# Altium project PCB_Project_1.PrjPcb
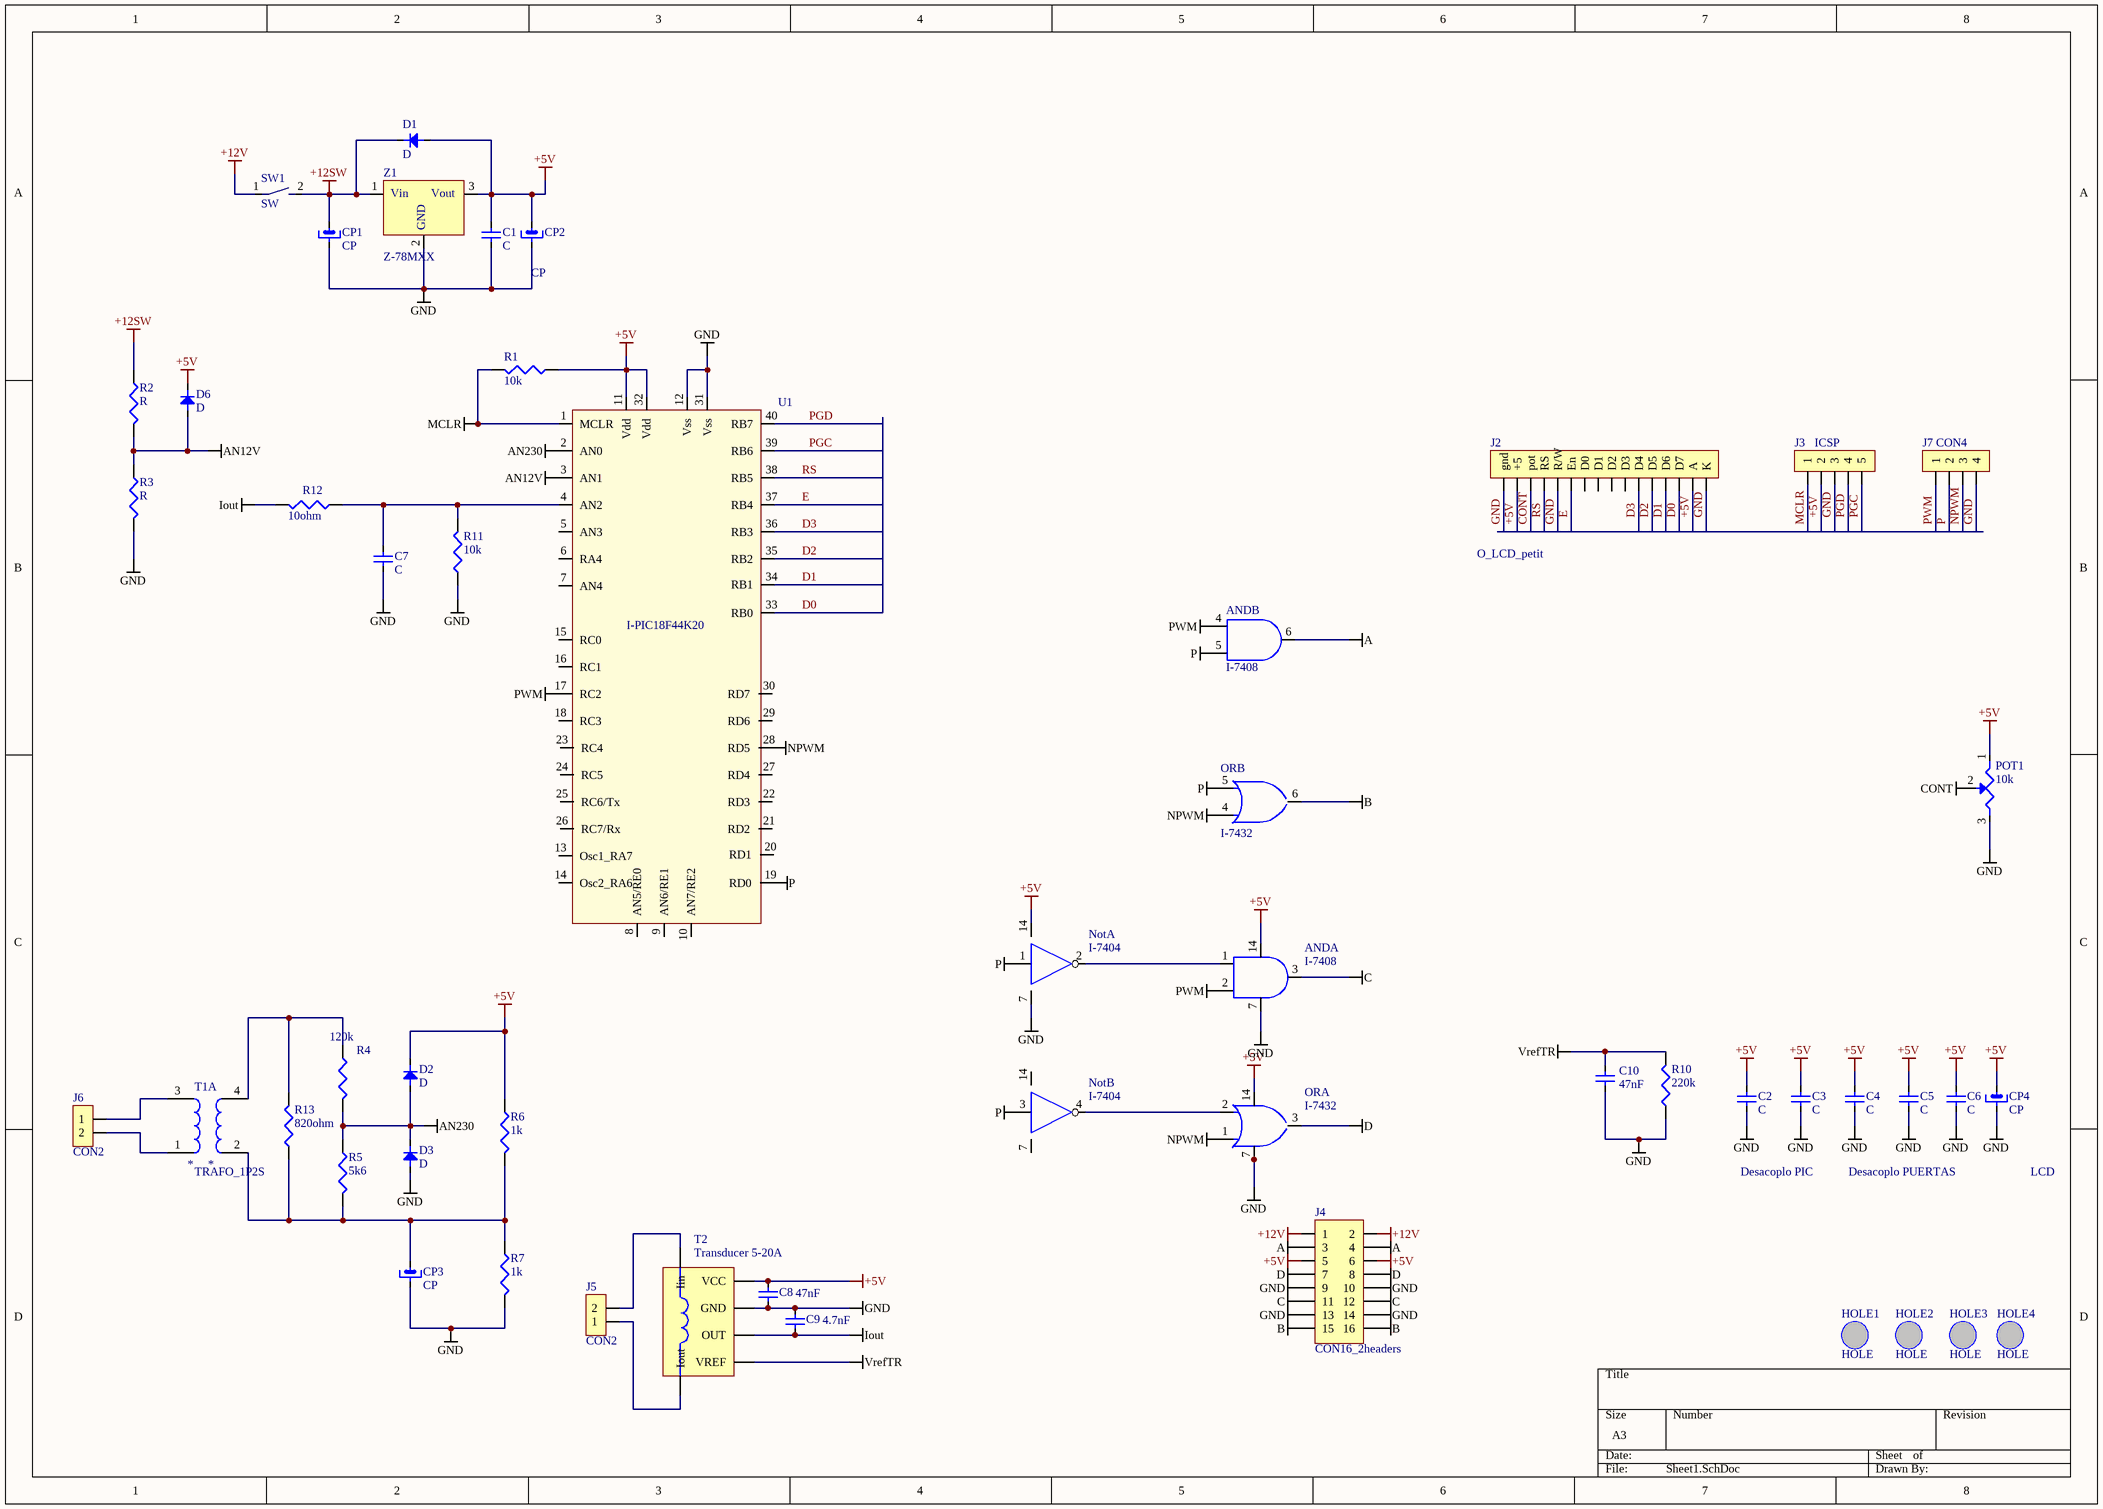
[diagram p0: Sheet1.SchDoc]
1 sheet, 48 parts. Net scope: global (net labels, ports and power ports of the same name join across sheets).
Board file: PCB1.PcbDoc

## Sheet Sheet1.SchDoc
size A3

### Parts
AND  I-7408  [DIP14]  (parts A,B of 4)
C1  C  [C2_200mils]
C2  C  [C2_200mils]
C3  C  [C2_200mils]
C4  C  [C2_200mils]
C5  C  [C2_200mils]
C6  C  [C2_200mils]
C7  C  [C2_200mils]
C8  47nF  [C2_200mils]
C9  4.7nF  [C2_200mils]
C10  47nF  [C2_200mils]
CP1  CP  [CP1_D5i5]
CP2  CP  [CP1_D5i5]
CP3  CP  [CP1_D5i5]
CP4  CP  [CP1_D5i5]
D1  D  [DO35]
D2  D  [DO35]
D3  D  [DO35]
D6  D  [DO35]
HOLE1  HOLE  [HOLE3_D6]
HOLE2  HOLE  [HOLE3_D6]
HOLE3  HOLE  [HOLE3_D6]
HOLE4  HOLE  [HOLE3_D6]
J2  O_LCD_petit  [O_LCDpetit]
J3  ICSP  [CON5_2I54V]
J4  CON16_2headers  [CON16-2headers]
J5  CON2  [CON2_5I08V_CP]
J6  CON2  [CON2_5I08V_CP]
J7  CON4  [CON4_2I54V]
Not  I-7404  [DIP14]  (parts A,B of 6)
OR  I-7432  [DIP14]  (parts A,B of 4)
POT1  10k  [PT15V]
R1  10k  [R1/4]
R2  R  [R1/4]
R3  R  [R1/4]
R4  120k  [R1/4]
R5  5k6  [R1/4]
R6  1k  [R1/4]
R7  1k  [R1/4]
R10  220k  [R1/4]
R11  10k  [R1/4]
R12  10ohm  [R1/4]
R13  820ohm  [R1/4]
SW1  SW  [SW1SPDT]
T1  TRAFO_1P2S  [TR_0.35/1/12]  (part A of 2)
T2  Transducer 5-20A  [HXS 20-NP]
U1  I-PIC18F44K20  [DIP40]
Z1  Z-78MXX  [TO220GDS_pla]

### Nets
+5V: AND.14(VCC) C1.1 C2.1 C3.1 C4.1 C5.1 C6.1 C8.1 CP2.1 CP4.1 D1.1 D2.2 D6.2 J2.2(+5) J2.15(A) J3.2 J4.5 J4.6 Not.14(VCC) OR.14 POT1.1 R1.1 R6.1 T2.9(VCC) U1.11(Vdd) U1.32(Vdd) Z1.3  [also labelled VCC]
+12SW: CP1.1 D1.2 R2.1 SW1.2 Z1.1
+12V: J4.1 J4.2 SW1.1
A: AND.6(BO) J4.3 J4.4
AN12V: D6.1 R2.2 R3.1 U1.3(AN1)
AN230: D2.1 D3.2 R4.2 R5.1 U1.2(AN0)
B: J4.15 J4.16 OR.6
C: AND.3(AO) J4.11 J4.12
CONT: J2.3(pot) POT1.2
D: J4.7 J4.8 OR.3
GND: AND.7(GND) C1.2 C2.2 C3.2 C4.2 C5.2 C6.2 C7.2 C8.2 C9.1 C10.2 CP1.2 CP2.2 CP3.2 CP4.2 D3.1 J2.1(gnd) J2.5(R/W) J2.16(K) J3.3 J4.9 J4.10 J4.13 J4.14 J7.4 Not.7(GND) OR.7 POT1.3 R3.2 R7.2 R10.1 R11.1 T2.10(GND) U1.12(Vss) U1.31(Vss) Z1.2
Iout: C9.2 R12.2 T2.11(OUT)
MCLR: J3.1 R1.2 U1.1(MCLR)
NPWM: J7.3 OR.1 OR.4 U1.28(RD5)
P: AND.5(B2) J7.2 Not.1 Not.3 OR.5 U1.19(RD0)
PWM: AND.2(A2) AND.4(B1) J7.1 U1.17(RC2)
VrefTR: C10.1 R10.2 T2.12(VREF)
D0: J2.14(D7) U1.33(RB0)
D1: J2.13(D6) U1.34(RB1)
D2: J2.12(D5) U1.35(RB2)
D3: J2.11(D4) U1.36(RB3)
E: J2.6(En) U1.37(RB4)
PGC: J3.5 U1.39(RB6)
PGD: J3.4 U1.40(RB7)
RS: J2.4(RS) U1.38(RB5)
NetAND_1: AND.1(A1) Not.2
NetC7_1: C7.1 R11.2 R12.1 U1.4(AN2)
NetCP3_1: CP3.1 R5.2 R6.2 R7.1 R13.1 T1.2
NetJ5_1: J5.1 T2.8(Iout)
NetJ5_2: J5.2 T2.1(Iin)
NetJ6_1: J6.1 T1.3
NetJ6_2: J6.2 T1.1
NetNot_4: Not.4 OR.2
NetR4_1: R4.1 R13.2 T1.4

Not connected (* = marked no-connect by the designer): J2 7(D0) 8(D1) 9(D2) 10(D3); U1 5(AN3) 6(RA4) 7(AN4) 8(AN5/RE0) 9(AN6/RE1) 10(AN7/RE2) 13(Osc1_RA7) 14(Osc2_RA6) 15(RC0) 16(RC1) 18(RC3) 20(RD1) 21(RD2) 22(RD3) 23(RC4) 24(RC5) 25(RC6/Tx) 26(RC7/Rx) 27(RD4) 29(RD6) 30(RD7)

### Notes on the sheet
- Desacoplo PIC
- Desacoplo PUERTAS
- LCD
- (in symbol Z-78MXX) Vin; Vout; GND

### Library data of the parts
AND = I-7408: Cuadruple 2 input Schmitt trigger NAND gate
C1-C10 = C: ;C?;C1206;C2_25x7i5;C4_15x5 ;C0805 ;Condensador baja potencia ;2
CP1-CP4 = CP: ;CP? ;CP1_D5i5 ;CP2_D10i5 ;CP2_D13 ;CP4_D36 ;Condensador polarizado ;3
D1-D3 D6 = D: ;D? ;SOD80;DO41 ;melf ;minimelf ; Diodo de señal o baja potencia ;8
HOLE1-HOLE4 = HOLE: ;HOLE? ;HOLE3_D6 ; ; ;Agujero ;20
J3 = CON5: ;J? ;CON5 ;CON5_2i54VE_JST_B2PVH ;CON5_7I62_STL960-HG-3 ;CON5_2I54V;Conector de 5 pins simples ;17
J4 = CON16_2headers: ;J? ;CON5 ;CON5_2i54VE_JST_B2PVH ;CON5_7I62_STL960-HG-3 ;CON5_2I54V;Conector de 5 pins simples ;17
J5 J6 = CON2: ;J? ;CON2 ;CON2_2i54VE_JST_B2PVH ;CON2_7I62_STL960-HG-3 ;CON2_2I54V ;Conector de 2 pins simples ;17
J7 = CON4: ;J? ;CON4 ;CON4_2i54VE_JST_B2PVH ;CON4_7I62_STL960-HG-3 ;CON4_2I54V ;Conector de 4 pins simples ;17
Not = I-7404: ;U? ;DIP-14 ; ; ; ;6xInversor trigger smith ;18
OR = I-7432: ;U? ;SOIC14 ; ; ; ; NOR x 4 ;18
POT1 = POT1: ;PT? ;PTV1 ;PT15V ;PTH ;PTH1 ;Potenciometro generico ;1
R1-R7 R10-R13 = R: ;R? ;R1206 ;R1/4 ;R1/2 ;R0805 ;Resistencia baja potencia (<=1/2W) ;1
SW1 = SW: ;SW? ; ; ; ; ;Switch ;
T1 = TRAFO_1P2S: ;T? ;TR-TOR1P-2S ; ; ; ;Transformador con 2 secundarios "2part" ;6
Z1 = Z-78MXX: ;Z? ;TO220 ;SOT233 ;TO220H_2COM ; ;Regulador Lineal ;11